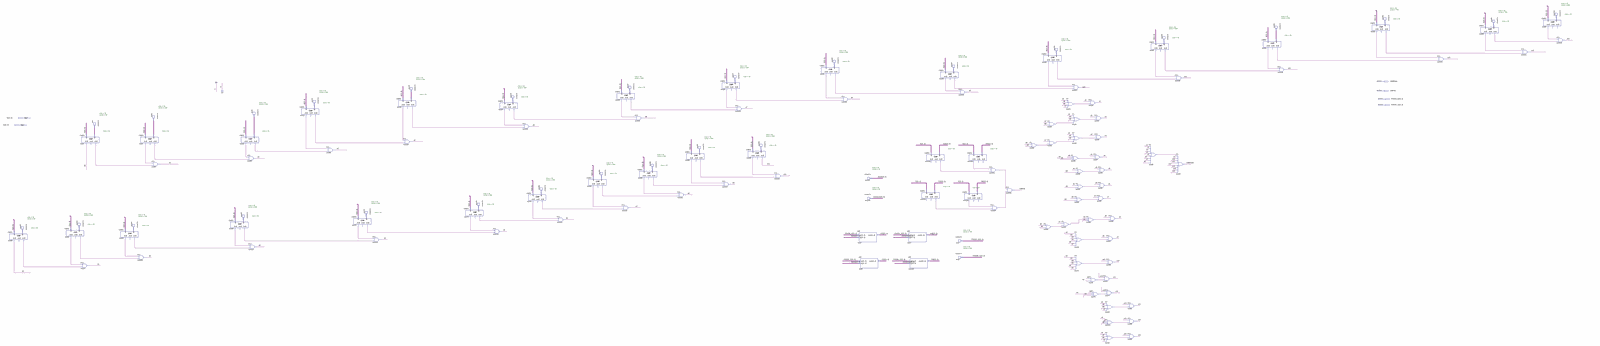
[diagram p0: schematic sheet, whole]
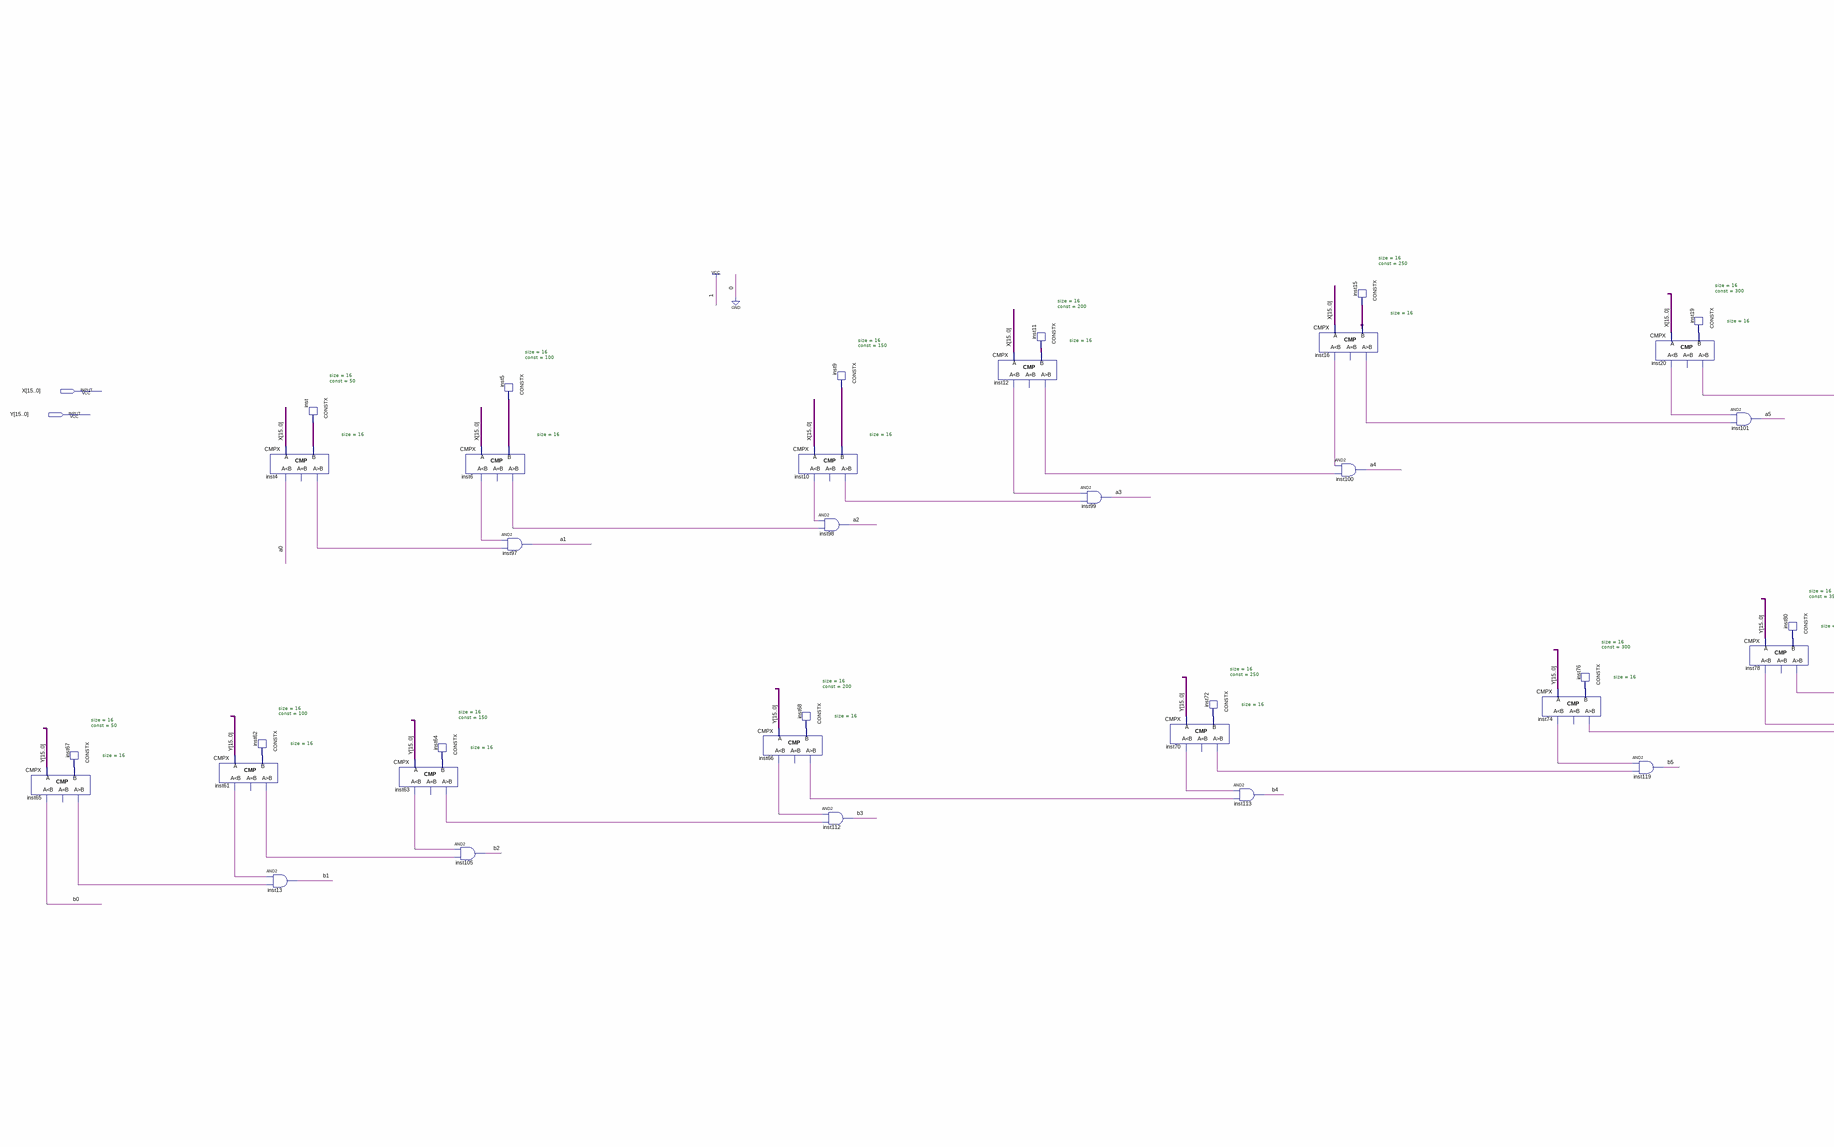
[diagram p1: schematic sheet, left part]
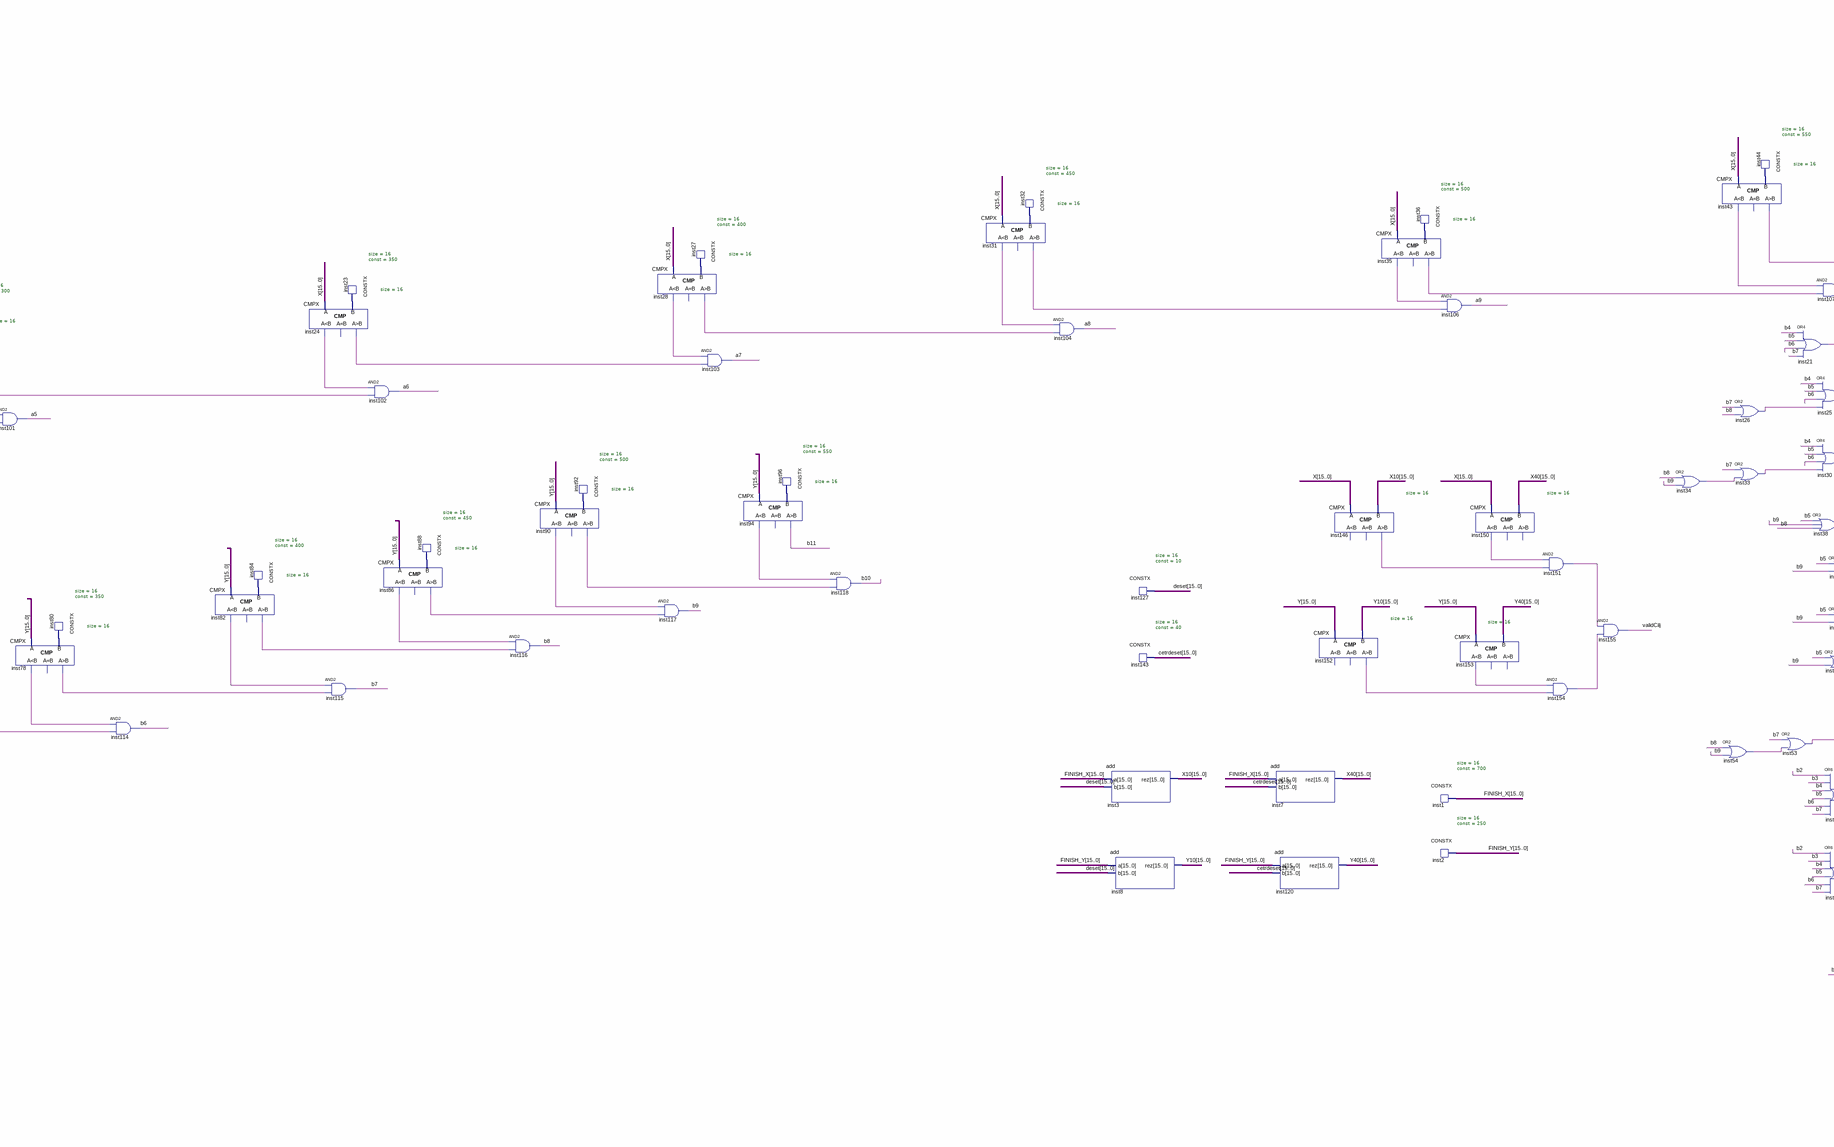
[diagram p2: schematic sheet, centre part]
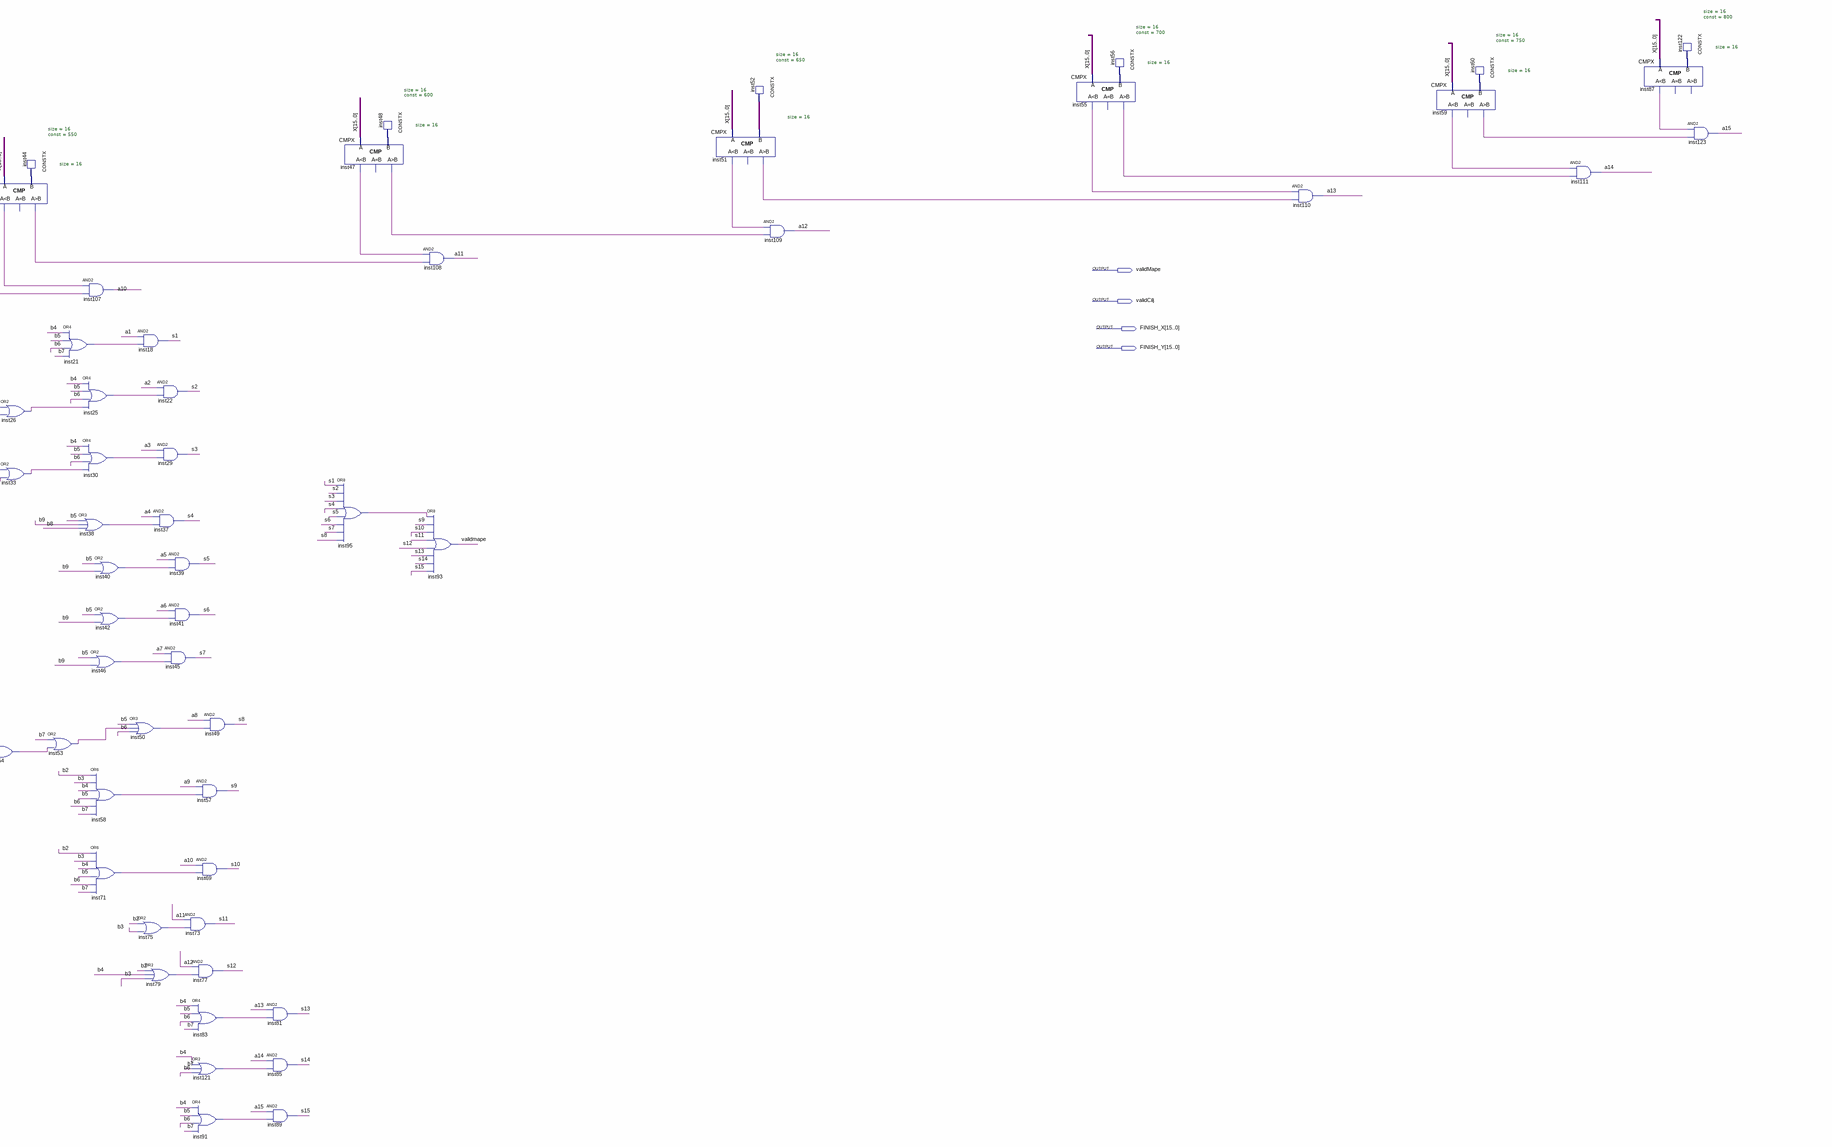
[diagram p3: schematic sheet, right part]
// Quartus schematic mapa3.bdf as structural Verilog: 131 symbols, 6 pins
module mapa3 (
  input  [15:0] X,
  input  [15:0] Y,
  output validMape,
  output validCilj,
  output [15:0] FINISH_X,
  output [15:0] FINISH_Y
);

  wire a0, a1, a2, a3, a4, a5, a6, a7, a8, a9, a10, a11, a12, a13, a14, a15, b0, b1, b2, b3, b4, b5, b6, b7,
       b8, b9, b10, b11, inst4_gr, inst6_gr, inst6_ls, inst10_gr, inst10_ls, inst12_gr, inst12_ls, inst16_gr,
       inst16_ls, inst20_gr, inst20_ls, inst21_out, inst24_gr, inst24_ls, inst25_out, inst26_out, inst28_gr,
       inst28_ls, inst30_out, inst31_gr, inst31_ls, inst33_out, inst34_out, inst35_gr, inst35_ls, inst38_out,
       inst40_out, inst42_out, inst43_gr, inst43_ls, inst46_out, inst47_gr, inst47_ls, inst50_out, inst51_gr,
       inst51_ls, inst53_out, inst54_out, inst55_gr, inst55_ls, inst58_out, inst59_gr, inst59_ls, inst61_gr,
       inst61_ls, inst63_gr, inst63_ls, inst65_gr, inst66_gr, inst66_ls, inst70_gr, inst70_ls, inst71_out,
       inst74_gr, inst74_ls, inst75_out, inst78_gr, inst78_ls, inst79_out, inst82_gr, inst82_ls, inst83_out,
       inst86_gr, inst86_ls, inst87_ls, inst90_gr, inst90_ls, inst91_out, inst94_ls, inst95_out, inst121_out,
       inst146_gr, inst150_ls, inst151_out, inst152_gr, inst153_ls, inst154_out, s1, s2, s3, s4, s5, s6, s7,
       s8, s9, s10, s11, s12, s13, s14, s15;
  wire [15:0] cetrdeset, deset, inst5_data, inst9_data, inst11_data, inst15_data, inst19_data, inst23_data,
       inst27_data, inst32_data, inst36_data, inst44_data, inst48_data, inst52_data, inst56_data,
       inst60_data, inst62_data, inst64_data, inst67_data, inst68_data, inst72_data, inst76_data,
       inst80_data, inst84_data, inst88_data, inst92_data, inst96_data, inst122_data, inst_data, X10, X40,
       Y10, Y40;

  CMPX #(.size(16)) inst65 (.A(Y), .B(inst67_data), .ls(b0), .gr(inst65_gr));  // open: eq
  CONSTX #(.size(16), .\const (50)) inst67 (.data(inst67_data));
  CMPX #(.size(16)) inst61 (.A(Y), .B(inst62_data), .ls(inst61_ls), .gr(inst61_gr));  // open: eq
  CMPX #(.size(16)) inst4 (.A(X), .B(inst_data), .ls(a0), .gr(inst4_gr));  // open: eq
  CONSTX #(.size(16), .\const (100)) inst62 (.data(inst62_data));
  and inst13 (b1, inst61_ls, inst65_gr);
  CONSTX #(.size(16), .\const (50)) inst (.data(inst_data));
  CMPX #(.size(16)) inst63 (.A(Y), .B(inst64_data), .ls(inst63_ls), .gr(inst63_gr));  // open: eq
  CONSTX #(.size(16), .\const (150)) inst64 (.data(inst64_data));
  CMPX #(.size(16)) inst6 (.A(X), .B(inst5_data), .ls(inst6_ls), .gr(inst6_gr));  // open: eq
  and inst105 (b2, inst63_ls, inst61_gr);
  CONSTX #(.size(16), .\const (100)) inst5 (.data(inst5_data));
  and inst97 (a1, inst6_ls, inst4_gr);
  CMPX #(.size(16)) inst66 (.A(Y), .B(inst68_data), .ls(inst66_ls), .gr(inst66_gr));  // open: eq
  CMPX #(.size(16)) inst10 (.A(X), .B(inst9_data), .ls(inst10_ls), .gr(inst10_gr));  // open: eq
  CONSTX #(.size(16), .\const (200)) inst68 (.data(inst68_data));
  CONSTX #(.size(16), .\const (150)) inst9 (.data(inst9_data));
  and inst98 (a2, inst10_ls, inst6_gr);
  and inst112 (b3, inst66_ls, inst63_gr);
  CMPX #(.size(16)) inst12 (.A(X), .B(inst11_data), .ls(inst12_ls), .gr(inst12_gr));  // open: eq
  CONSTX #(.size(16), .\const (200)) inst11 (.data(inst11_data));
  and inst99 (a3, inst12_ls, inst10_gr);
  CMPX #(.size(16)) inst70 (.A(Y), .B(inst72_data), .ls(inst70_ls), .gr(inst70_gr));  // open: eq
  CONSTX #(.size(16), .\const (250)) inst72 (.data(inst72_data));
  and inst113 (b4, inst70_ls, inst66_gr);
  CMPX #(.size(16)) inst16 (.A(X), .B(inst15_data), .ls(inst16_ls), .gr(inst16_gr));  // open: eq
  and inst100 (a4, inst16_ls, inst12_gr);
  CONSTX #(.size(16), .\const (250)) inst15 (.data(inst15_data));
  CMPX #(.size(16)) inst74 (.A(Y), .B(inst76_data), .ls(inst74_ls), .gr(inst74_gr));  // open: eq
  CONSTX #(.size(16), .\const (300)) inst76 (.data(inst76_data));
  CMPX #(.size(16)) inst20 (.A(X), .B(inst19_data), .ls(inst20_ls), .gr(inst20_gr));  // open: eq
  and inst119 (b5, inst74_ls, inst70_gr);
  CONSTX #(.size(16), .\const (300)) inst19 (.data(inst19_data));
  and inst101 (a5, inst20_ls, inst16_gr);
  CMPX #(.size(16)) inst78 (.A(Y), .B(inst80_data), .ls(inst78_ls), .gr(inst78_gr));  // open: eq
  CONSTX #(.size(16), .\const (350)) inst80 (.data(inst80_data));
  and inst114 (b6, inst78_ls, inst74_gr);
  CMPX #(.size(16)) inst82 (.A(Y), .B(inst84_data), .ls(inst82_ls), .gr(inst82_gr));  // open: eq
  CONSTX #(.size(16), .\const (400)) inst84 (.data(inst84_data));
  CMPX #(.size(16)) inst24 (.A(X), .B(inst23_data), .ls(inst24_ls), .gr(inst24_gr));  // open: eq
  and inst115 (b7, inst82_ls, inst78_gr);
  CONSTX #(.size(16), .\const (350)) inst23 (.data(inst23_data));
  and inst102 (a6, inst24_ls, inst20_gr);
  CMPX #(.size(16)) inst86 (.A(Y), .B(inst88_data), .ls(inst86_ls), .gr(inst86_gr));  // open: eq
  CONSTX #(.size(16), .\const (450)) inst88 (.data(inst88_data));
  and inst116 (b8, inst86_ls, inst82_gr);
  CMPX #(.size(16)) inst90 (.A(Y), .B(inst92_data), .ls(inst90_ls), .gr(inst90_gr));  // open: eq
  CONSTX #(.size(16), .\const (500)) inst92 (.data(inst92_data));
  CMPX #(.size(16)) inst28 (.A(X), .B(inst27_data), .ls(inst28_ls), .gr(inst28_gr));  // open: eq
  and inst117 (b9, inst90_ls, inst86_gr);
  CONSTX #(.size(16), .\const (400)) inst27 (.data(inst27_data));
  and inst103 (a7, inst28_ls, inst24_gr);
  CMPX #(.size(16)) inst94 (.A(Y), .B(inst96_data), .ls(inst94_ls), .gr(b11));  // open: eq
  CONSTX #(.size(16), .\const (550)) inst96 (.data(inst96_data));
  and inst118 (b10, inst94_ls, inst90_gr);
  CMPX #(.size(16)) inst31 (.A(X), .B(inst32_data), .ls(inst31_ls), .gr(inst31_gr));  // open: eq
  CONSTX #(.size(16), .\const (450)) inst32 (.data(inst32_data));
  and inst104 (a8, inst31_ls, inst28_gr);
  add inst3 (.a(FINISH_X), .b(deset), .rez(X10));
  add inst8 (.a(FINISH_Y), .b(deset), .rez(Y10));
  CONSTX #(.size(16), .\const (10)) inst127 (.data(deset));
  CONSTX #(.size(16), .\const (40)) inst143 (.data(cetrdeset));
  add inst7 (.a(FINISH_X), .b(cetrdeset), .rez(X40));
  add inst120 (.a(FINISH_Y), .b(cetrdeset), .rez(Y40));
  CMPX #(.size(16)) inst146 (.A(X), .B(X10), .gr(inst146_gr));  // open: ls, eq
  CMPX #(.size(16)) inst152 (.A(Y), .B(Y10), .gr(inst152_gr));  // open: ls, eq
  CMPX #(.size(16)) inst35 (.A(X), .B(inst36_data), .ls(inst35_ls), .gr(inst35_gr));  // open: eq
  CONSTX #(.size(16), .\const (500)) inst36 (.data(inst36_data));
  and inst106 (a9, inst35_ls, inst31_gr);
  CMPX #(.size(16)) inst153 (.A(Y), .B(Y40), .ls(inst153_ls));  // open: eq, gr
  CONSTX #(.size(16), .\const (700)) inst1 (.data(FINISH_X));
  CONSTX #(.size(16), .\const (250)) inst2 (.data(FINISH_Y));
  CMPX #(.size(16)) inst150 (.A(X), .B(X40), .ls(inst150_ls));  // open: eq, gr
  and inst151 (inst151_out, inst150_ls, inst146_gr);
  and inst154 (inst154_out, inst153_ls, inst152_gr);
  and inst155 (validCilj, inst151_out, inst154_out);
  or inst34 (inst34_out, b8, b9);
  CMPX #(.size(16)) inst43 (.A(X), .B(inst44_data), .ls(inst43_ls), .gr(inst43_gr));  // open: eq
  or inst26 (inst26_out, b7, b8);
  or inst33 (inst33_out, b7, inst34_out);
  or inst54 (inst54_out, b8, b9);
  CONSTX #(.size(16), .\const (550)) inst44 (.data(inst44_data));
  or inst21 (inst21_out, b4, b5, b6, b7);
  or inst53 (inst53_out, b7, inst54_out);
  and inst107 (a10, inst43_ls, inst35_gr);
  or inst25 (inst25_out, b4, b5, b6, inst26_out);
  or inst30 (inst30_out, b4, b5, b6, inst33_out);
  or inst38 (inst38_out, b5, b9, b8);
  or inst40 (inst40_out, b5, b9);
  or inst42 (inst42_out, b5, b9);
  or inst46 (inst46_out, b5, b9);
  or inst58 (inst58_out, b2, b3, b4, b5, b6, b7);
  or inst71 (inst71_out, b2, b3, b4, b5, b6, b7);
  or inst50 (inst50_out, b5, inst53_out, b6);
  and inst18 (s1, a1, inst21_out);
  and inst22 (s2, a2, inst25_out);
  and inst29 (s3, a3, inst30_out);
  and inst37 (s4, a4, inst38_out);
  or inst75 (inst75_out, b2, b3);
  or inst79 (inst79_out, b2, b4, b3);
  and inst39 (s5, a5, inst40_out);
  and inst41 (s6, a6, inst42_out);
  and inst45 (s7, a7, inst46_out);
  and inst73 (s11, a11, inst75_out);
  and inst77 (s12, a12, inst79_out);
  or inst83 (inst83_out, b4, b5, b6, b7);
  or inst121 (inst121_out, b4, b7, b6);
  or inst91 (inst91_out, b4, b5, b6, b7);
  and inst49 (s8, a8, inst50_out);
  and inst57 (s9, a9, inst58_out);
  and inst69 (s10, a10, inst71_out);
  and inst81 (s13, a13, inst83_out);
  and inst85 (s14, a14, inst121_out);
  and inst89 (s15, a15, inst91_out);
  CMPX #(.size(16)) inst47 (.A(X), .B(inst48_data), .ls(inst47_ls), .gr(inst47_gr));  // open: eq
  or inst95 (inst95_out, s1, s2, s3, s4, s5, s6, s7, s8);
  CONSTX #(.size(16), .\const (600)) inst48 (.data(inst48_data));
  and inst108 (a11, inst47_ls, inst43_gr);
  or inst93 (validMape, inst95_out, s9, s10, s11, s12, s13, s14, s15);
  CMPX #(.size(16)) inst51 (.A(X), .B(inst52_data), .ls(inst51_ls), .gr(inst51_gr));  // open: eq
  CONSTX #(.size(16), .\const (650)) inst52 (.data(inst52_data));
  and inst109 (a12, inst51_ls, inst47_gr);
  CMPX #(.size(16)) inst55 (.A(X), .B(inst56_data), .ls(inst55_ls), .gr(inst55_gr));  // open: eq
  CONSTX #(.size(16), .\const (700)) inst56 (.data(inst56_data));
  and inst110 (a13, inst55_ls, inst51_gr);
  CMPX #(.size(16)) inst59 (.A(X), .B(inst60_data), .ls(inst59_ls), .gr(inst59_gr));  // open: eq
  CONSTX #(.size(16), .\const (750)) inst60 (.data(inst60_data));
  and inst111 (a14, inst59_ls, inst55_gr);
  CMPX #(.size(16)) inst87 (.A(X), .B(inst122_data), .ls(inst87_ls));  // open: eq, gr
  CONSTX #(.size(16), .\const (800)) inst122 (.data(inst122_data));
  and inst123 (a15, inst87_ls, inst59_gr);
endmodule
